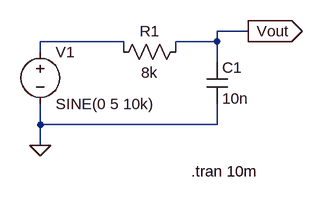
[diagram p0: schematic project_RC.asc]
project_RC.asc, the LTspice schematic file:
Version 4
SHEET 1 880 680
WIRE 352 96 304 96
WIRE 160 112 32 112
WIRE 304 112 304 96
WIRE 304 112 240 112
WIRE 32 128 32 112
WIRE 160 128 160 112
WIRE 240 128 240 112
WIRE 304 144 304 112
WIRE 32 240 32 208
WIRE 304 240 304 208
WIRE 304 240 32 240
WIRE 32 272 32 240
FLAG 32 272 0
FLAG 352 96 Vout
IOPIN 352 96 Out
SYMBOL voltage 32 112 R0
WINDOW 123 0 0 Left 0
WINDOW 39 0 0 Left 0
SYMATTR InstName V1
SYMATTR Value SINE(0 5 10k)
SYMBOL cap 288 144 R0
SYMATTR InstName C1
SYMATTR Value 10n
SYMBOL res 256 112 R90
WINDOW 0 0 56 VBottom 2
WINDOW 3 32 56 VTop 2
SYMATTR InstName R1
SYMATTR Value 8k
TEXT 264 312 Left 2 !.tran 10m

The netlist it stands for:
* project_RC.asc
V1 N001 0 SINE(0 5 10k)
C1 Vout 0 10n
R1 Vout N001 8k
.tran 10m
.backanno
.end